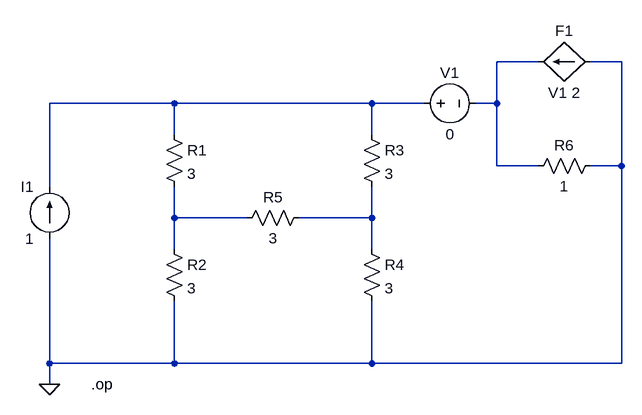
[diagram p0: schematic CH03-KP2-03.asc]
CH03-KP2-03.asc, the LTspice schematic file:
Version 4
SHEET 1 880 680
WIRE 544 112 480 112
WIRE 672 112 624 112
WIRE -16 176 -208 176
WIRE 288 176 -16 176
WIRE 368 176 288 176
WIRE 480 176 480 112
WIRE 480 176 448 176
WIRE -16 224 -16 176
WIRE 288 224 288 176
WIRE 480 272 480 176
WIRE 544 272 480 272
WIRE 672 272 672 112
WIRE 672 272 624 272
WIRE -208 304 -208 176
WIRE -16 352 -16 304
WIRE 96 352 -16 352
WIRE 288 352 288 304
WIRE 288 352 176 352
WIRE -16 400 -16 352
WIRE 288 400 288 352
WIRE -208 576 -208 384
WIRE -16 576 -16 480
WIRE -16 576 -208 576
WIRE 288 576 288 480
WIRE 288 576 -16 576
WIRE 672 576 672 272
WIRE 672 576 288 576
WIRE -208 608 -208 576
FLAG -208 608 0
DATAFLAG -128 176 "$"
SYMBOL res -32 208 R0
SYMATTR InstName R1
SYMATTR Value 3
SYMBOL res -32 384 R0
SYMATTR InstName R2
SYMATTR Value 3
SYMBOL res 272 208 R0
SYMATTR InstName R3
SYMATTR Value 3
SYMBOL res 272 384 R0
SYMATTR InstName R4
SYMATTR Value 3
SYMBOL res 192 336 R90
WINDOW 0 0 56 VBottom 2
WINDOW 3 32 56 VTop 2
SYMATTR InstName R5
SYMATTR Value 3
SYMBOL res 640 256 R90
WINDOW 0 0 56 VBottom 2
WINDOW 3 32 56 VTop 2
SYMATTR InstName R6
SYMATTR Value 1
SYMBOL voltage 352 176 R270
WINDOW 0 32 56 VTop 2
WINDOW 3 -32 56 VBottom 2
SYMATTR InstName V1
SYMATTR Value 0
SYMBOL f 624 112 R90
WINDOW 0 -32 40 VBottom 2
WINDOW 3 32 40 VTop 2
SYMATTR InstName F1
SYMATTR Value V1 2
SYMBOL current -208 384 R180
WINDOW 0 24 80 Left 2
WINDOW 3 24 0 Left 2
SYMATTR InstName I1
SYMATTR Value 1
TEXT -144 608 Left 2 !.op

The netlist it stands for:
* CH03-KP2-03.asc
R1 N002 N003 3
R2 N003 0 3
R3 N002 N004 3
R4 N004 0 3
R5 N004 N003 3
R6 0 N001 1
V1 N002 N001 0
F1 0 N001 V1 2
I1 0 N002 1
.op
.backanno
.end